# EAGLE design PD_breadboard (EAGLE 9.7.0)
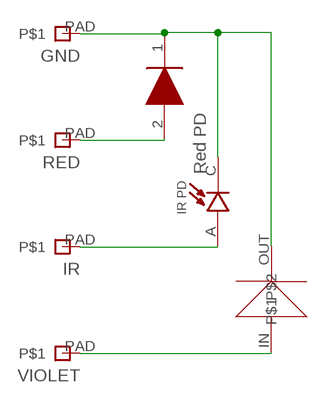
[diagram p0: schematic, sheet 1]

## Parts
D1  REDPD  [SFH2713]
D2  IRPD  [XDCR_VEMD2023X01]
GND  PAD  [PAD]
IR  PAD  [PAD]
RED  PAD  [PAD]
U$1  UVPD  [UVPD]
VIOLET  PAD  [PAD]

## Nets
N$1: D1.2(A) RED.PAD
N$2: D1.1(K) D2.C GND.PAD U$1.OUT
N$3: D2.A IR.PAD
N$4: U$1.IN VIOLET.PAD

## Library data of the parts
D1 = MABOS_Library:REDPD: Photodiodes Silicon PIN Photodiode Source: Datasheet <https://dammedia.osram.info/media/resource/hires/osram-dam-8960377/SFH 2713_EN.pdf>; DESCRIPTION: Photodiodes Silicon PIN Photodiode; HEIGHT: 0.7mm; MANUFACTURER_NAME: OSRAM; MANUFACTURER_PART_NUMBER: SFH 2713; MOUSER_PART_NUMBER: 720-SFH2713; MOUSER_PRICE-STOCK: https://www.mouser.co.uk/ProductDetail/OSRAM-Opto-Semiconductors/SFH-2713?qs=7MVldsJ5UayBhtoy5c4X7w%3D%3D
D2 = MABOS_Library:IRPD: Check availability <https://pricing.snapeda.com/parts/VEMD2023X01/Vishay%20Semiconductor/view-part?ref=eda>; AVAILABILITY: In Stock; DESCRIPTION: Photodiode 940nm 100ns 70° 2-SMD; MF: Vishay Semiconductor; MP: VEMD2023X01; PACKAGE: SMD-2 Vishay Semiconductor; PRICE: None; PURCHASE-URL: https://pricing.snapeda.com/search/part/VEMD2023X01/?ref=eda
GND IR RED VIOLET = Nordic_BLE:PAD
U$1 = MABOS_Library:UVPD

## Board
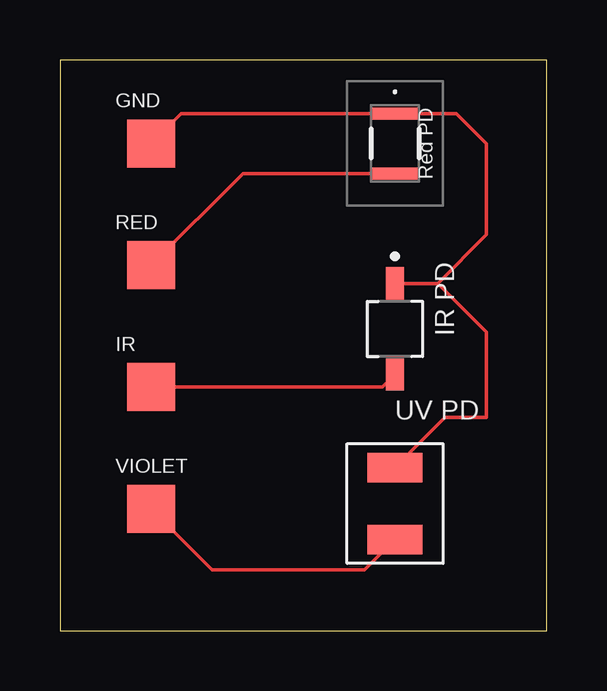
[diagram p1: board, top side]

Size 20.3 x 23.8 mm. Coordinates in mm from the lower left corner, seen from the top.
Outline: 0,0 20.3,0 20.3,23.8 0,23.8 0,0
Copper layers (1*16): Top / Bottom
Stack-up Default Layer Stack: Top User Defined 0.035mm / Dielectric-1 User Defined 1.5mm / Bottom User Defined 0.035mm
Design rules "default": minimum track width 6mil, minimum drill 0.35mm, track to track 6mil, track to pad 6mil, pad to pad 6mil, via to via 6mil, smd to smd 6mil, copper to edge 40mil, drill to drill 6mil, minimum pad ring 10mil, minimum via ring 8mil, stop-mask expansion 4mil, vias tented up to drill 0mil, thermal gap 10mil

### Footprints (pad centres in the part's own frame; a part is rotated, then mirrored left to right if it is on the bottom)
SFH2713 = smd 0.5 x 1.9: 1 -1.25,0; 2 1.25,0
XDCR_VEMD2023X01 = smd 1.35 x 0.75: A 1.9,0; C -1.9,0
PAD = smd 2 x 2: PAD 0,0
UVPD = smd 2.3 x 1.23: IN 0,0; OUT 0,3

### Placement (x,y rotation side)
D1  13.97,20.32 270 top
D2  13.97,12.58 270 top
GND  3.81,20.32 0 top
IR  3.81,10.16 0 top
RED  3.81,15.24 0 top
U$1  13.97,3.81 0 top
VIOLET  3.81,5.08 0 top

### Tracks (layer width: path | path; a pad name or v marks a point on that pad's centre or on a via)
N$1
  Top 0.152: RED.PAD 7.64,19.07 D1.2
N$2
  Top 0.152: GND.PAD 5.06,21.57 D1.1 16.53,21.57 17.78,20.32 17.78,16.51 15.75,14.48 | 15.75,14.48 D2.C | U$1.OUT 16.05,8.89 17.78,8.89 17.78,12.46 15.75,14.48
N$3
  Top 0.152: D2.A 13.45,10.16 IR.PAD
N$4
  Top 0.152: VIOLET.PAD 6.35,2.54 12.7,2.54 U$1.IN